# Altium schematic sheet Main.SchDoc
size Letter
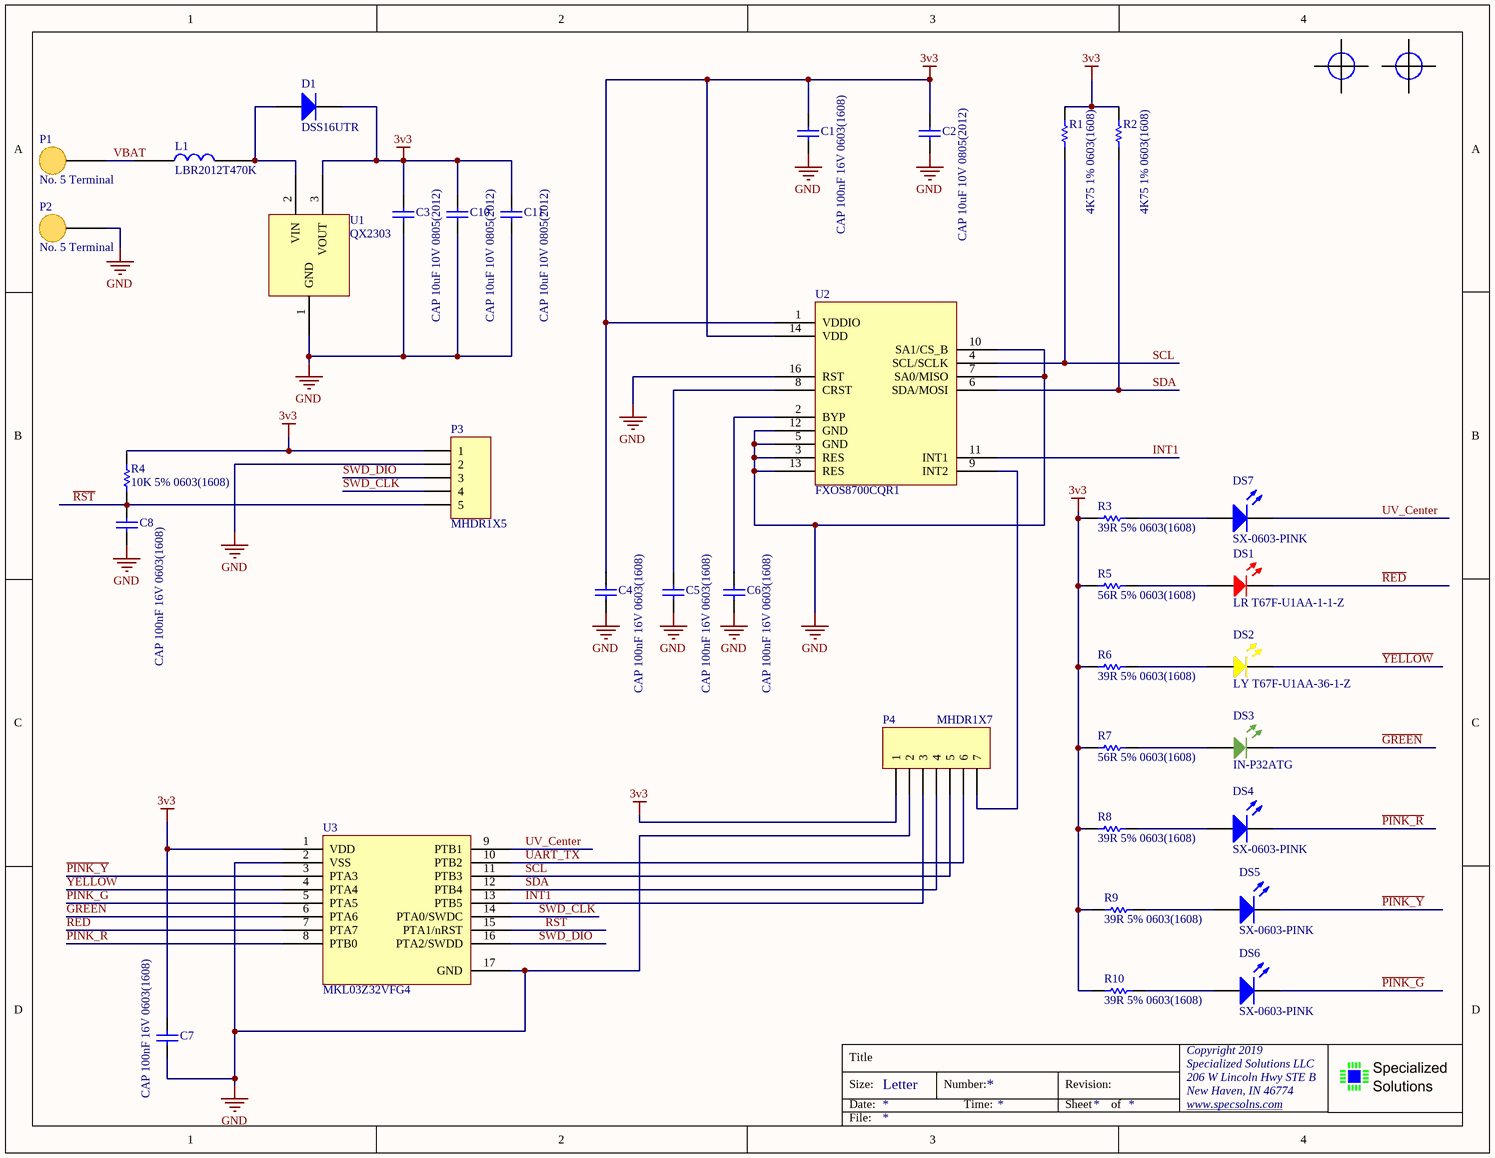
[diagram p0: Main.SchDoc]

## Parts
(Parts that share a designator on the sheet are numbered #1, #2 ... from top to bottom, then left to right.)
?#1  Fiducial (Cross)  [Fiducial - Cross]  (value not drawn)  (no BOM)
?#2  Fiducial (Cross)  [Fiducial - Cross]  (value not drawn)  (no BOM)
C1  CAP 100nF 16V 0603(1608)  [CAPC0603(1608)100_N]
C2  CAP 10uF 10V 0805(2012)  [CAPC0805(2012)145_N]
C3  CAP 10uF 10V 0805(2012)  [CAPC0805(2012)145_N]
C4  CAP 100nF 16V 0603(1608)  [CAPC0603(1608)100_N]
C5  CAP 100nF 16V 0603(1608)  [CAPC0603(1608)100_N]
C6  CAP 100nF 16V 0603(1608)  [CAPC0603(1608)100_N]
C7  CAP 100nF 16V 0603(1608)  [CAPC0603(1608)100_N]
C8  CAP 100nF 16V 0603(1608)  [CAPC0603(1608)100_N]
C10  CAP 10uF 10V 0805(2012)  [CAPC0805(2012)145_N]
C11  CAP 10uF 10V 0805(2012)  [CAPC0805(2012)145_N]
D1  DSS16UTR  [MCC-SOD-123FL_V]
DS1  LR T67F-U1AA-1-1-Z  [LR T67F-U1AA-1-1-Z]
DS2  LY T67F-U1AA-36-1-Z  [LY T67F-U1AA-36-1-Z]
DS3  IN-P32ATG  [IN-P32ATG]
DS4  SX-0603-PINK  [LITE-ON-LTST-C191KRKT-2_V]
DS5  SX-0603-PINK  [LITE-ON-LTST-C191KRKT-2_V]
DS6  SX-0603-PINK  [LITE-ON-LTST-C191KRKT-2_V]
DS7  SX-0603-PINK  [LITE-ON-LTST-C191KRKT-2_V]
L1  LBR2012T470K  [0805 Inductor]
P1  No. 5 Terminal  [AA Battery Terminal]
P2  No. 5 Terminal  [AA Battery Terminal]
P3  MHDR1X5  [MHDR1X5]
P4  MHDR1X7  [MHDR1X7]
R1  4K75 1% 0603(1608)  [RESC0603(1608)_L]
R2  4K75 1% 0603(1608)  [RESC0603(1608)_L]
R3  39R 5% 0603(1608)  [RESC0603(1608)_N]
R4  10K 5% 0603(1608)  [RESC0603(1608)_N]
R5  56R 5% 0603(1608)  [RESC0603(1608)_N]
R6  39R 5% 0603(1608)  [RESC0603(1608)_N]
R7  56R 5% 0603(1608)  [RESC0603(1608)_N]
R8  39R 5% 0603(1608)  [RESC0603(1608)_N]
R9  39R 5% 0603(1608)  [RESC0603(1608)_N]
R10  39R 5% 0603(1608)  [RESC0603(1608)_N]
U1  QX2303  [SOT95P237X111-3N]
U2  FXOS8700CQR1  [QFN50P300X300X120-16N]
U3  MKL03Z32VFG4  [PQFN50P300X300X6_HS-17N]

## Nets
3v3: C1.2 C2.1 C3.1 C4.2 C7.2 C10.1 C11.1 D1.2(K) P3.1 P4.1 R1.2 R2.2 R3.1 R4.2 R5.1 R6.1 R7.1 R8.1 R9.1 R10.1 U1.3(VOUT) U2.1(VDDIO) U2.14(VDD) U3.1(VDD)
GND: C1.1 C2.2 C3.2 C4.1 C5.1 C6.1 C7.1 C8.1 C10.2 C11.2 P2.1 P3.2 P4.2 U1.1(GND) U2.3(RES) U2.5(GND) U2.7(SA0/MISO) U2.10(SA1/CS_B) U2.12(GND) U2.13(RES) U2.16(RST) U3.2(VSS) U3.17(GND)
~{GREEN}: DS3.2(Cathode) U3.6(PTA6)
~{PINK_G}: DS6.2(K) U3.5(PTA5)
~{PINK_R}: DS4.2(K) U3.8(PTB0)
~{PINK_Y}: DS5.2(K) U3.3(PTA3)
~{RED}: DS1.2(Cathode) U3.7(PTA7)
~{RST}: C8.2 P3.5 R4.1 U3.15(PTA1/nRST)
~{YELLOW}: DS2.2(Cathode) U3.4(PTA4)
INT1: P4.3 U2.11(INT1) U3.13(PTB5)
SCL: P4.5 R1.1 U2.4(SCL/SCLK) U3.11(PTB3)
SDA: P4.4 R2.1 U2.6(SDA/MOSI) U3.12(PTB4)
SWD_CLK: P3.4 U3.14(PTA0/SWDC)
SWD_DIO: P3.3 U3.16(PTA2/SWDD)
UART_TX: P4.6 U3.10(PTB2)
UV_Center: DS7.2(K) U3.9(PTB1)
VBAT: L1.1 P1.1
NetC5_2: C5.2 U2.8(CRST)
NetC6_2: C6.2 U2.2(BYP)
NetD1_1: D1.1(A) L1.2 U1.2(VIN)
NetDS1_1: DS1.1(Anode) R5.2
NetDS2_1: DS2.1(Anode) R6.2
NetDS3_1: DS3.1(Anode) R7.2
NetDS4_1: DS4.1(A) R8.2
NetDS5_1: DS5.1(A) R9.2
NetDS6_1: DS6.1(A) R10.2
NetDS7_1: DS7.1(A) R3.2
NetP4_7: P4.7 U2.9(INT2)

Not connected (* = marked no-connect by the designer): ?#1 0; ?#2 0

## Notes on the sheet
- Title
- Size:
- Date:
- Letter
- Number:
- Time:
- Revision:
- Sheet
- of
- Copyright 2019
- Specialized Solutions LLC
- 206 W Lincoln Hwy STE B
- New Haven, IN 46774
- www.specsolns.com <http://www.specsolns.com>
- File:

## Library data of the parts
?#1 ?#2 = Fiducial - Cross
C1 C4-C8 = CMP-1035-02585-1: CAP 100nF 16V ±20% 0603 (1608 Metric) Thickness 1mm SMD; Case-EIA: 0603; Tolerance: Â±20%; Case-Metric: 1608; Technology: SMT; Rated Voltage: 16 V; Value: 100nF; Max Thickness: 1 mm
C2 C3 C10 C11 = CMP-1036-04924-1: CAP 10uF 10V ±20% 0805 (2012 Metric) Thickness 1.45mm SMD; Case-EIA: 0805; Case-Metric: 2012; Tolerance: Â±20%; Rated Voltage: 10 V; Max Thickness: 1.45 mm; Value: 10uF; Technology: SMT
D1 = CMP-2000-07084-1: SCHOTTKY 60V SOD-123FL; Manufacturer: Micro Commercial Components; Diode Configuration: Single; Diode Type: StandardRecovery; Forward Surge Current Ifsm Max: 30A; Forward Current If(AV): 1A; Forward Voltage VF Max: 1.1V; Repetitive Reverse Voltage Vrrm Max: 1kV; Manufacturer URL: http://www.mccsemi.com/; Datasheet URL: http://www.mccsemi.com/up_pdf/SM4001PL-SM4007PL(SOD-123FL).PDF; Package Description: 2-Pin Small Outline Diode, Flat Lead, Body 2.825 x 1.65 mm; Datasheet Version: Rev. H, 05/2015; Package Reference: SOD-123FL; Mounting Technology: SurfaceMount
DS1 = LR T67F-U1AA-1-1-Z: PLCC-2 SMD RED 625nm
DS2 = LY T67F-U1AA-36-1-Z: PLCC-2 SMD YELOW 590nm
DS3 = IN-P32ATG: PLCC-2 SMD True Green 527nm
DS4-DS7 = CMP-2000-05198-1: Chip LED, Green, 574 nm, 40 pF, -55 to 85 degC, 2-Pin SMD, RoHS, Tape and Reel; Manufacturer: Lite-On; Rad Hardened: No; Emitting Color: YellowGreen; Product Height (mm): 0.55mm; Forward Voltage: 2.4V; Number of Elements: 1; Dominant Wave Length: 571nm; DELETED: Compliant; Viewing Angle: 130deg; High Brightness: Yes; Peak Wavelength: 574nm; Type: Uni-Color; Forward Current: 30mA; Product Length (mm): 1.6mm; Luminous Intensity: 35mcd; Test Current (It): 20mA; Chip Material: AlGaInP; Product Depth (mm): 0.8mm; Shape Type: Rectangular; Reverse Voltage: 5V; Power Dissipation: 75W; Pin Count: 2; Lens Dimensions: 1.1X0.8X0.37mm; Packaging: TapeandReel; Main Category: ChipLED; Operating Temperature Classification: Industrial; Package Type: ChipLed; Mounting: SurfaceMount; Lum Intensity: 35mcd; Operating Temp Range: -55Cto85C; Datasheet Version: Jan-07; Datasheet URL: http://download.siliconexpert.com/pdfs/2007/08/26/semi_b/manual/lot/ds/ltst-c191kgkt.pdf; Manufacturer URL: http://www.us.liteon.com/
L1 = LQM21PN1R0NGRD: FIXED IND 47UH 75MA 1.7 OHM SMD
P1 P2 = AA Battery Terminal: AA Battery Terminal No. 5
P3 = MHDR1X5: Header, 5-Pin; LatestRevisionDate: 17-Jul-2002; LatestRevisionNote: Re-released for DXP Platform.; Publisher: Altium Limited
P4 = MHDR1X7: Header, 7-Pin; LatestRevisionDate: 17-Jul-2002; LatestRevisionNote: Re-released for DXP Platform.; Publisher: Altium Limited
R1 R2 = CMP-1012-00587-1: 4K75 0.1W 1% 0603 (1608 Metric)  SMD; Value: 4750.00 Ohm; Case-EIA: 0603; Case-Metric: 1608; Technology: SMT; Power: 0.1 W; Tolerance: 1 %
R3 R6 R8-R10 = CMP-1012-00040-1: 39R 0.1W 5% 0603 (1608 Metric)  SMD; Case-Metric: 1608; Case-EIA: 0603; Value: 39.00 Ohm; Tolerance: 5 %; Technology: SMT; Power: 0.1 W
R4 = CMP-1012-00098-1: 10K 0.1W 5% 0603 (1608 Metric)  SMD; Case-EIA: 0603; Value: 10000.00 Ohm; Case-Metric: 1608; Technology: SMT; Tolerance: 5 %; Power: 0.1 W
R5 R7 = CMP-1012-00044-1: 56R 0.1W 5% 0603 (1608 Metric)  SMD; Case-EIA: 0603; Case-Metric: 1608; Value: 56.00 Ohm; Technology: SMT; Power: 0.1 W; Tolerance: 5 %
U1 = QX2303: 3.3V BOOST
U2 = FXOS8700CQR1: 6-axis sensor with integrated linear accelerometer and magnetometer
U3 = MKL03Z32VFG4: Kinetis KL03 32 KB Flash QFN 16